# EasyEDA Pro project Sensor_colis_examples.epro, board 2024-06-03_06-25-29
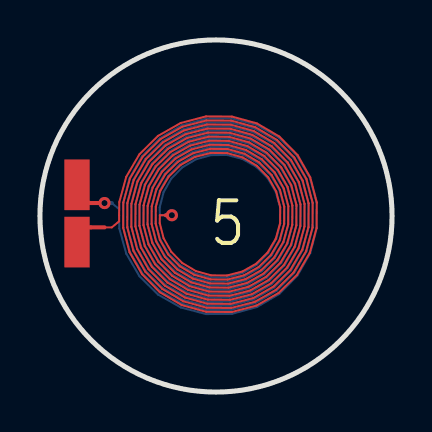
[diagram p8: board, top side]
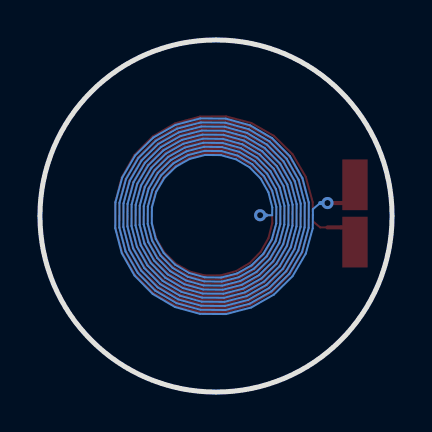
[diagram p9: board, bottom side, seen from below]

Outline 17.63 x 17.63 mm; copper layers: Top Layer, Bottom Layer. Coordinates in mm from the lower left corner of the outline.
Outline path: circle c8.82,8.82 r8.82
Stack: Top Layer 0.035mm - / Dielectric1 1.51mm FR4 er 4.5 / Bottom Layer 0.035mm -

## Design rules (mm)
template: 用户自定义配置
spacing safeClearance (default): track to track 0.152, other pairs 0.152 to 0.3
track width trackWidth (default): min 0.025, default 0.254, max 2.54
differential pair differentialPair (default): width min 0.127, default 0.254, max 2.54; gap min 0.152, default 0.152
via viaSize (default): diameter min 0.5, default 0.61, max 10; hole min 0.3, default 0.305, max 5.999

## Placement (name value [footprint] x y rotation side)
CSENSOR  -  [0402]  1.86 8.94 90 top

## Footprints (pads in the part's own frame, mm; a bottom-side part is the same pattern mirrored in y, then rotated)
0402
  rect 2.54x1.27 smd: 1(-1.435,0) 2(1.435,0)

## Nets
3: CSENSOR.1 CSENSOR.2

## Via types
v1: diameter 0.61, hole 0.305, Top Layer to Bottom Layer, 2 vias

## Routing (per net, layer and track width the routed paths; a pad name or vN(x,y) marks a point on that pad's centre or on a via; arc(x,y) is an arc through that point)
3: length 509.3
  Top Layer w0.102: 6.31,8.86 6.01,8.86 6,8.47 6.19,7.71 6.58,7.02 7.13,6.46 7.81,6.06 8.57,5.85 9.36,5.84 10.13,6.04 10.83,6.43 11.4,6.99 11.81,7.68 12.03,8.45 12.03,9.26 11.83,10.04 11.43,10.75 10.87,11.33 10.16,11.75 9.37,11.97 8.55,11.98 7.76,11.77 7.04,11.37 6.45,10.79 6.03,10.07 5.8,9.27 5.79,8.44 6,7.63 6.41,6.9 7,6.3 7.73,5.87 8.54,5.64 9.39,5.63 10.21,5.85 10.95,6.26 11.56,6.86 12,7.6 12.23,8.43 12.24,9.29 12.02,10.12 11.6,10.88 10.99,11.5 10.24,11.94 9.4,12.17 8.53,12.18 7.68,11.96 6.91,11.53 6.29,10.91 5.84,10.15 5.6,9.3 5.59,8.41 5.81,7.55 6.25,6.77 6.88,6.14 7.65,5.68 8.52,5.44 9.42,5.43 10.29,5.66 11.08,6.1 11.73,6.74 12.19,7.52 12.43,8.4 12.44,9.31 12.21,10.2 11.76,11 11.11,11.66 10.32,12.13 9.43,12.37 8.5,12.38 7.6,12.15 6.79,11.69 6.12,11.04 5.65,10.23 5.4,9.33 5.39,8.39 5.62,7.47 6.09,6.65 6.75,5.97 7.57,5.49 8.49,5.24 9.44,5.23 10.37,5.47 11.2,5.94 11.89,6.61 12.38,7.44 12.63,8.37 12.64,9.34 12.4,10.28 11.92,11.12 11.24,11.82 10.4,12.32 9.46,12.58 8.47,12.59 7.52,12.34 6.66,11.85 5.96,11.16 5.46,10.31 5.19,9.35 5.18,8.36 5.43,7.39 5.93,6.52 6.63,5.81 7.49,5.3 8.46,5.03 9.47,5.03 10.45,5.28 11.33,5.78 12.05,6.49 12.57,7.36 12.84,8.35 12.85,9.37 12.59,10.36 12.09,11.25 11.36,11.98 10.48,12.51 9.48,12.78 8.45,12.79 7.44,12.53 6.54,12.02 5.8,11.29 5.27,10.39 4.99,9.38 4.98,8.33 5.25,7.31 5.76,6.4 6.5,5.65 7.41,5.11 8.44,4.83 9.5,4.82 10.53,5.09 11.45,5.61 12.21,6.36 12.76,7.29 13.04,8.32 13.05,9.39 12.78,10.44 12.25,11.37 11.49,12.14 10.56,12.69 9.51,12.98 8.42,12.99 7.37,12.72 6.41,12.18 5.63,11.41 5.08,10.47 4.79,9.41 4.78,8.31 5.06,7.24 5.6,6.28 6.38,5.49 7.34,4.92 8.41,4.63 9.52,4.62 10.6,4.9 11.58,5.45 12.38,6.24 12.95,7.21 13.25,8.29 13.25,9.42 12.97,10.51 12.41,11.5 11.61,12.31 10.63,12.88 9.53,13.19 8.39,13.2 7.29,12.91 6.29,12.34 5.47,11.54 4.89,10.54 4.58,9.43 4.57,8.28 4.87,7.16 5.44,6.15 6.25,5.32 7.26,4.73 8.38,4.42 9.55,4.42 10.68,4.71 11.7,5.29 12.54,6.11 13.13,7.13 13.45,8.27 13.46,9.45 13.16,10.59 12.57,11.62 11.74,12.47 10.71,13.07 9.56,13.39 8.37,13.4 7.21,13.1 6.17,12.5 5.31,11.66 4.7,10.62 4.38,9.46 4.37,8.25 4.68,7.08 5.28,6.03 6.13,5.16 7.18,4.54 8.35,4.22 9.58,4.21 10.76,4.52 11.83,5.13 12.7,5.99 13.32,7.05 13.65,8.24 13.66,9.47 13.35,10.67 12.74,11.75 11.86,12.63 10.79,13.26 9.59,13.59 8.34,13.6 7.13,13.29 6.04,12.67 5.15,11.79 4.51,10.7 4.18,9.49 4.17,8.22 4.49,7 5.11,5.9 6,5 7.1,4.36 8.33,4.02 9.6,4.01 10.84,4.33 11.95,4.96 12.86,5.86 13.51,6.97 13.85,8.21 13.86,9.5 13.54,10.75 12.9,11.87 11.99,12.8 10.87,13.45 9.62,13.8 8.31,13.8 7.05,13.48 5.92,12.83 4.98,11.91 4.32,10.78 3.97,9.51 3.97,8.86 3.97,8.55 3.6,8.25 3.23,8.25
  Top Layer w0.203: 3.23,8.25 1.87,8.25 ; v1(3.23,9.47) 2.55,9.47 1.87,9.55 1.87,9.64 ; 6.31,8.86 v1(6.61,8.86)
  Bottom Layer w0.102: 3.6,9.47 3.97,9.16 3.97,8.86 3.97,8.2 4.32,6.93 4.98,5.8 5.92,4.88 7.05,4.24 8.31,3.91 9.62,3.92 10.87,4.26 11.99,4.92 12.9,5.84 13.54,6.96 13.86,8.21 13.85,9.5 13.51,10.74 12.86,11.85 11.95,12.75 10.84,13.38 9.6,13.7 8.33,13.69 7.1,13.36 6,12.71 5.11,11.81 4.49,10.71 4.17,9.49 4.18,8.23 4.51,7.01 5.15,5.93 6.04,5.05 7.13,4.43 8.34,4.11 9.59,4.12 10.79,4.45 11.86,5.08 12.74,5.96 13.35,7.04 13.66,8.24 13.65,9.47 13.32,10.66 12.7,11.72 11.83,12.59 10.76,13.19 9.58,13.5 8.35,13.49 7.18,13.17 6.13,12.55 5.28,11.69 4.68,10.63 4.37,9.46 4.38,8.25 4.7,7.09 5.31,6.05 6.17,5.21 7.21,4.62 8.37,4.31 9.56,4.32 10.71,4.64 11.74,5.24 12.57,6.09 13.16,7.12 13.46,8.26 13.45,9.45 13.13,10.58 12.54,11.6 11.7,12.42 10.68,13 9.55,13.3 8.38,13.29 7.26,12.98 6.25,12.39 5.44,11.56 4.87,10.55 4.57,9.43 4.58,8.28 4.89,7.17 5.47,6.18 6.29,5.37 7.29,4.8 8.39,4.52 9.53,4.53 10.63,4.83 11.61,5.4 12.41,6.21 12.97,7.2 13.25,8.29 13.25,9.42 12.95,10.5 12.38,11.47 11.58,12.26 10.6,12.81 9.52,13.09 8.41,13.09 7.34,12.79 6.38,12.23 5.6,11.44 5.06,10.48 4.78,9.41 4.79,8.31 5.08,7.25 5.63,6.3 6.41,5.53 7.37,4.99 8.42,4.72 9.51,4.73 10.56,5.02 11.49,5.57 12.25,6.34 12.78,7.28 13.05,8.32 13.04,9.39 12.76,10.43 12.21,11.35 11.45,12.1 10.53,12.62 9.5,12.89 8.44,12.88 7.41,12.6 6.5,12.06 5.76,11.31 5.25,10.4 4.98,9.38 4.99,8.33 5.27,7.33 5.8,6.43 6.54,5.7 7.44,5.18 8.45,4.92 9.48,4.93 10.48,5.21 11.36,5.73 12.09,6.46 12.59,7.35 12.85,8.34 12.84,9.37 12.57,10.35 12.05,11.22 11.33,11.94 10.45,12.43 9.47,12.69 8.46,12.68 7.49,12.41 6.63,11.9 5.93,11.19 5.43,10.32 5.18,9.35 5.19,8.36 5.46,7.4 5.96,6.55 6.66,5.86 7.52,5.37 8.47,5.13 9.46,5.14 10.4,5.4 11.24,5.89 11.92,6.59 12.4,7.43 12.64,8.37 12.63,9.34 12.38,10.27 11.89,11.1 11.2,11.77 10.37,12.24 9.44,12.48 8.49,12.48 7.57,12.22 6.75,11.74 6.09,11.06 5.62,10.24 5.39,9.33 5.4,8.39 5.65,7.48 6.12,6.67 6.79,6.02 7.6,5.56 8.5,5.33 9.43,5.34 10.32,5.59 11.11,6.05 11.76,6.71 12.21,7.51 12.44,8.4 12.43,9.31 12.19,10.19 11.73,10.97 11.08,11.61 10.29,12.06 9.42,12.28 8.52,12.27 7.65,12.03 6.88,11.58 6.25,10.94 5.81,10.16 5.59,9.3 5.6,8.41 5.84,7.56 6.29,6.8 6.91,6.18 7.68,5.75 8.53,5.53 9.4,5.54 10.24,5.78 10.99,6.22 11.6,6.84 12.02,7.59 12.24,8.42 12.23,9.29 12,10.11 11.56,10.85 10.95,11.45 10.21,11.87 9.39,12.08 8.54,12.07 7.73,11.84 7,11.41 6.41,10.81 6,10.08 5.79,9.27 5.8,8.44 6.03,7.64 6.45,6.92 7.04,6.35 7.76,5.94 8.55,5.74 9.37,5.74 10.16,5.96 10.87,6.38 11.43,6.96 11.83,7.67 12.03,8.45 12.03,9.26 11.81,10.03 11.4,10.73 10.83,11.28 10.13,11.68 9.36,11.87 8.57,11.87 7.81,11.65 7.13,11.25 6.58,10.69 6.19,10 6,9.25 6.01,8.86 6.31,8.86
  Bottom Layer w0.203: 3.6,9.47 v1(3.23,9.47) ; 6.31,8.86 v1(6.61,8.86)

## Text on the board
Top Silkscreen Layer: Layers = 2 | Turns = 10 | Version - 1.1 | -------------- | Design Id - 107 | Coil Parameters | Customized for LDC1612 | Trace Width = 4.0 mils | Layer Stack Information | Trace Spacing = 4.0 mils | ------------------------- | WEBENCH Design Information | Copper thickness = 1.0 Oz-Cu | Exported on - 2024/06/03 06:25:27 | Inner Diameter = 234 mils (Approx.) | Outer Diameter = 394 mils (Approx.) | Space between TOP and BOTTOM = 4.0 mils | Exported from WEBENCH Coil Designer Tool | 5
